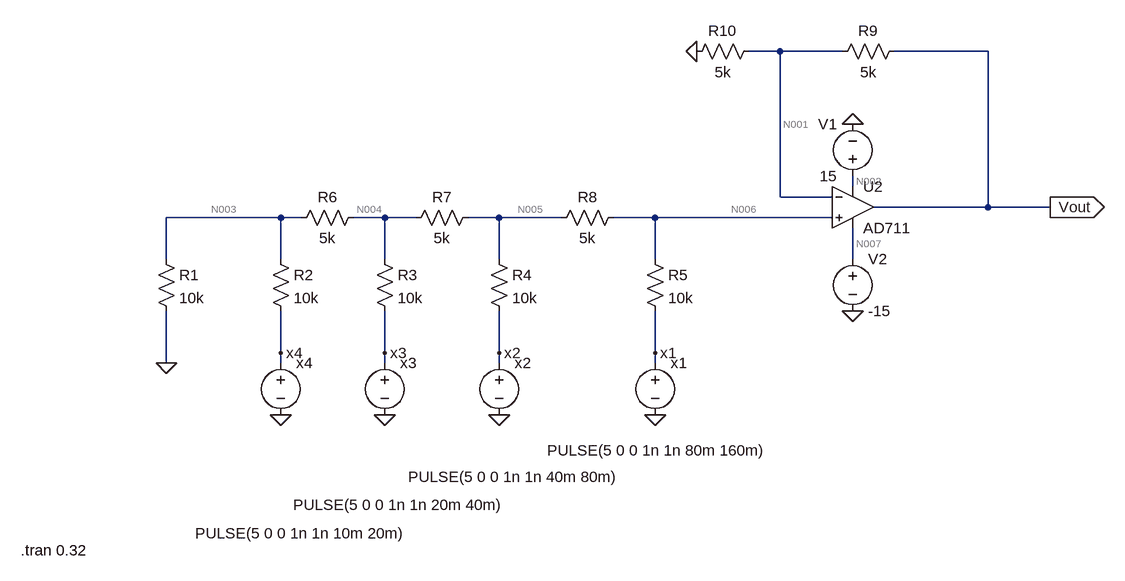
[diagram p0: schematic Draft.asc]
Draft.asc, the LTspice schematic file:
Version 4
SHEET 1 1024 872
WIRE 496 -64 448 -64
WIRE 592 -64 496 -64
WIRE 816 -64 672 -64
WIRE 608 144 608 128
WIRE 496 160 496 -64
WIRE 576 160 496 160
WIRE 816 176 816 -64
WIRE 816 176 640 176
WIRE 912 176 816 176
WIRE -272 192 -448 192
WIRE -240 192 -272 192
WIRE -112 192 -160 192
WIRE -64 192 -112 192
WIRE 64 192 16 192
WIRE 160 192 64 192
WIRE 304 192 240 192
WIRE 576 192 304 192
WIRE -448 256 -448 192
WIRE -272 256 -272 192
WIRE -112 256 -112 192
WIRE 64 256 64 192
WIRE 304 256 304 192
WIRE 608 256 608 208
WIRE -272 400 -272 336
WIRE -112 400 -112 336
WIRE 64 400 64 336
WIRE 304 400 304 336
WIRE -448 416 -448 336
WIRE -272 416 -272 400
WIRE -112 416 -112 400
WIRE 64 416 64 400
WIRE 304 416 304 400
FLAG 368 -64 0
FLAG -448 416 0
FLAG 608 48 0
FLAG 608 336 0
FLAG -272 496 0
FLAG -112 496 0
FLAG 64 496 0
FLAG 912 176 Vout
IOPIN 912 176 Out
FLAG -272 400 x4
FLAG -112 400 x3
FLAG 64 400 x2
FLAG 304 496 0
FLAG 304 400 x1
SYMBOL res -464 240 R0
SYMATTR InstName R1
SYMATTR Value 10k
SYMBOL res -288 240 R0
SYMATTR InstName R2
SYMATTR Value 10k
SYMBOL res -128 240 R0
SYMATTR InstName R3
SYMATTR Value 10k
SYMBOL res 48 240 R0
SYMATTR InstName R4
SYMATTR Value 10k
SYMBOL res -144 176 R90
WINDOW 0 0 56 VBottom 2
WINDOW 3 32 56 VTop 2
SYMATTR InstName R6
SYMATTR Value 5k
SYMBOL res 32 176 R90
WINDOW 0 0 56 VBottom 2
WINDOW 3 32 56 VTop 2
SYMATTR InstName R7
SYMATTR Value 5k
SYMBOL res 464 -80 R90
WINDOW 0 0 56 VBottom 2
WINDOW 3 32 56 VTop 2
SYMATTR InstName R10
SYMATTR Value 5k
SYMBOL res 688 -80 R90
WINDOW 0 0 56 VBottom 2
WINDOW 3 32 56 VTop 2
SYMATTR InstName R9
SYMATTR Value 5k
SYMBOL voltage 64 400 R0
WINDOW 123 0 0 Left 0
WINDOW 39 0 0 Left 0
WINDOW 3 -140 191 Left 2
SYMATTR Value PULSE(5 0 0 1n 1n 40m 80m)
SYMATTR InstName x2
SYMBOL voltage -112 400 R0
WINDOW 123 0 0 Left 0
WINDOW 39 0 0 Left 0
WINDOW 3 -141 234 Left 2
SYMATTR Value PULSE(5 0 0 1n 1n 20m 40m)
SYMATTR InstName x3
SYMBOL voltage -272 400 R0
WINDOW 123 0 0 Left 0
WINDOW 39 0 0 Left 0
WINDOW 3 -132 278 Left 2
SYMATTR Value PULSE(5 0 0 1n 1n 10m 20m)
SYMATTR InstName x4
SYMBOL voltage 608 240 R0
WINDOW 123 0 0 Left 0
WINDOW 39 0 0 Left 0
SYMATTR InstName V2
SYMATTR Value -15
SYMBOL voltage 608 144 R180
WINDOW 0 24 96 Left 2
WINDOW 3 24 16 Left 2
WINDOW 123 0 0 Left 0
WINDOW 39 0 0 Left 0
SYMATTR InstName V1
SYMATTR Value 15
SYMBOL res 256 176 R90
WINDOW 0 0 56 VBottom 2
WINDOW 3 32 56 VTop 2
SYMATTR InstName R8
SYMATTR Value 5k
SYMBOL res 288 240 R0
SYMATTR InstName R5
SYMATTR Value 10k
SYMBOL voltage 304 400 R0
WINDOW 3 -166 150 Left 2
WINDOW 123 0 0 Left 0
WINDOW 39 0 0 Left 0
SYMATTR InstName x1
SYMATTR Value PULSE(5 0 0 1n 1n 80m 160m)
SYMBOL OpAmps\\AD711 608 112 R0
SYMATTR InstName U2
TEXT -672 704 Left 2 !.tran 0.32

The netlist it stands for:
* Draft.asc
R1 N003 0 10k
R2 N003 x4 10k
R3 N004 x3 10k
R4 N005 x2 10k
R6 N004 N003 5k
R7 N005 N004 5k
R10 N001 0 5k
R9 Vout N001 5k
V§x2 x2 0 PULSE(5 0 0 1n 1n 40m 80m)
V§x3 x3 0 PULSE(5 0 0 1n 1n 20m 40m)
V§x4 x4 0 PULSE(5 0 0 1n 1n 10m 20m)
V2 N007 0 -15
V1 N002 0 15
R8 N006 N005 5k
R5 N006 x1 10k
V§x1 x1 0 PULSE(5 0 0 1n 1n 80m 160m)
XU2 N006 N001 N002 N007 Vout AD712  ; AD711, pins In+ In- V+ V- OUT
.tran 0.32
.lib ADI1.lib
.backanno
.end

* Results of the author's LTspice run, read from the files saved beside the schematic
* Operating Point, zero values left out:
*   V(n003) = 3.32 V
*   V(x4) = 5 V
*   V(n004) = 4.141 V
*   V(x3) = 5 V
*   V(n005) = 4.531 V
*   V(x2) = 5 V
*   V(n001) = 4.687 V
*   V(vout) = 9.375 V
*   V(n007) = -15 V
*   V(n002) = 15 V
*   V(n006) = 4.688 V
*   V(x1) = 5 V
*   I(R1) = 332 µA
*   I(R2) = -168 µA
*   I(R3) = -85.94 µA
*   I(R4) = -46.88 µA
*   I(R6) = 164.1 µA
*   I(R7) = 78.12 µA
*   I(R10) = 937.5 µA
*   I(R9) = 937.5 µA
*   I(R8) = 31.25 µA
*   I(R5) = -31.25 µA
*   I(X2) = -46.88 µA
*   I(X3) = -85.94 µA
*   I(X4) = -168 µA
*   I(V2) = 4.694 mA
*   I(V1) = -5.631 mA
*   I(X1) = -31.25 µA
*   Ix(u2:1) = 37.5 pA
*   Ix(u2:2) = 37.5 pA
*   Ix(u2:3) = 5.631 mA
*   Ix(u2:4) = -4.694 mA
*   Ix(u2:5) = -937.5 µA
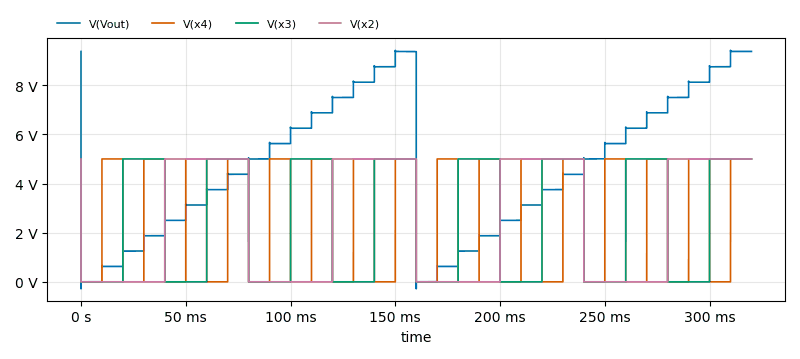
[diagram p1: Transient Analysis of Draft.asc, plotted from the saved traces]
* Transient Analysis, 1 run:
*   V(Vout): min -283.9 mV, max 9.419 V, average 4.687 V, rms 5.502 V, last 9.375 V
*   V(x4): min 0 V, max 5 V, average 2.5 V, rms 3.536 V, last 5 V
*   V(x3): min 0 V, max 5 V, average 2.5 V, rms 3.536 V, last 5 V
*   V(x2): min 0 V, max 5 V, average 2.5 V, rms 3.536 V, last 5 V